# EAGLE design dsbrut2_2bit (EAGLE 6.5.0)
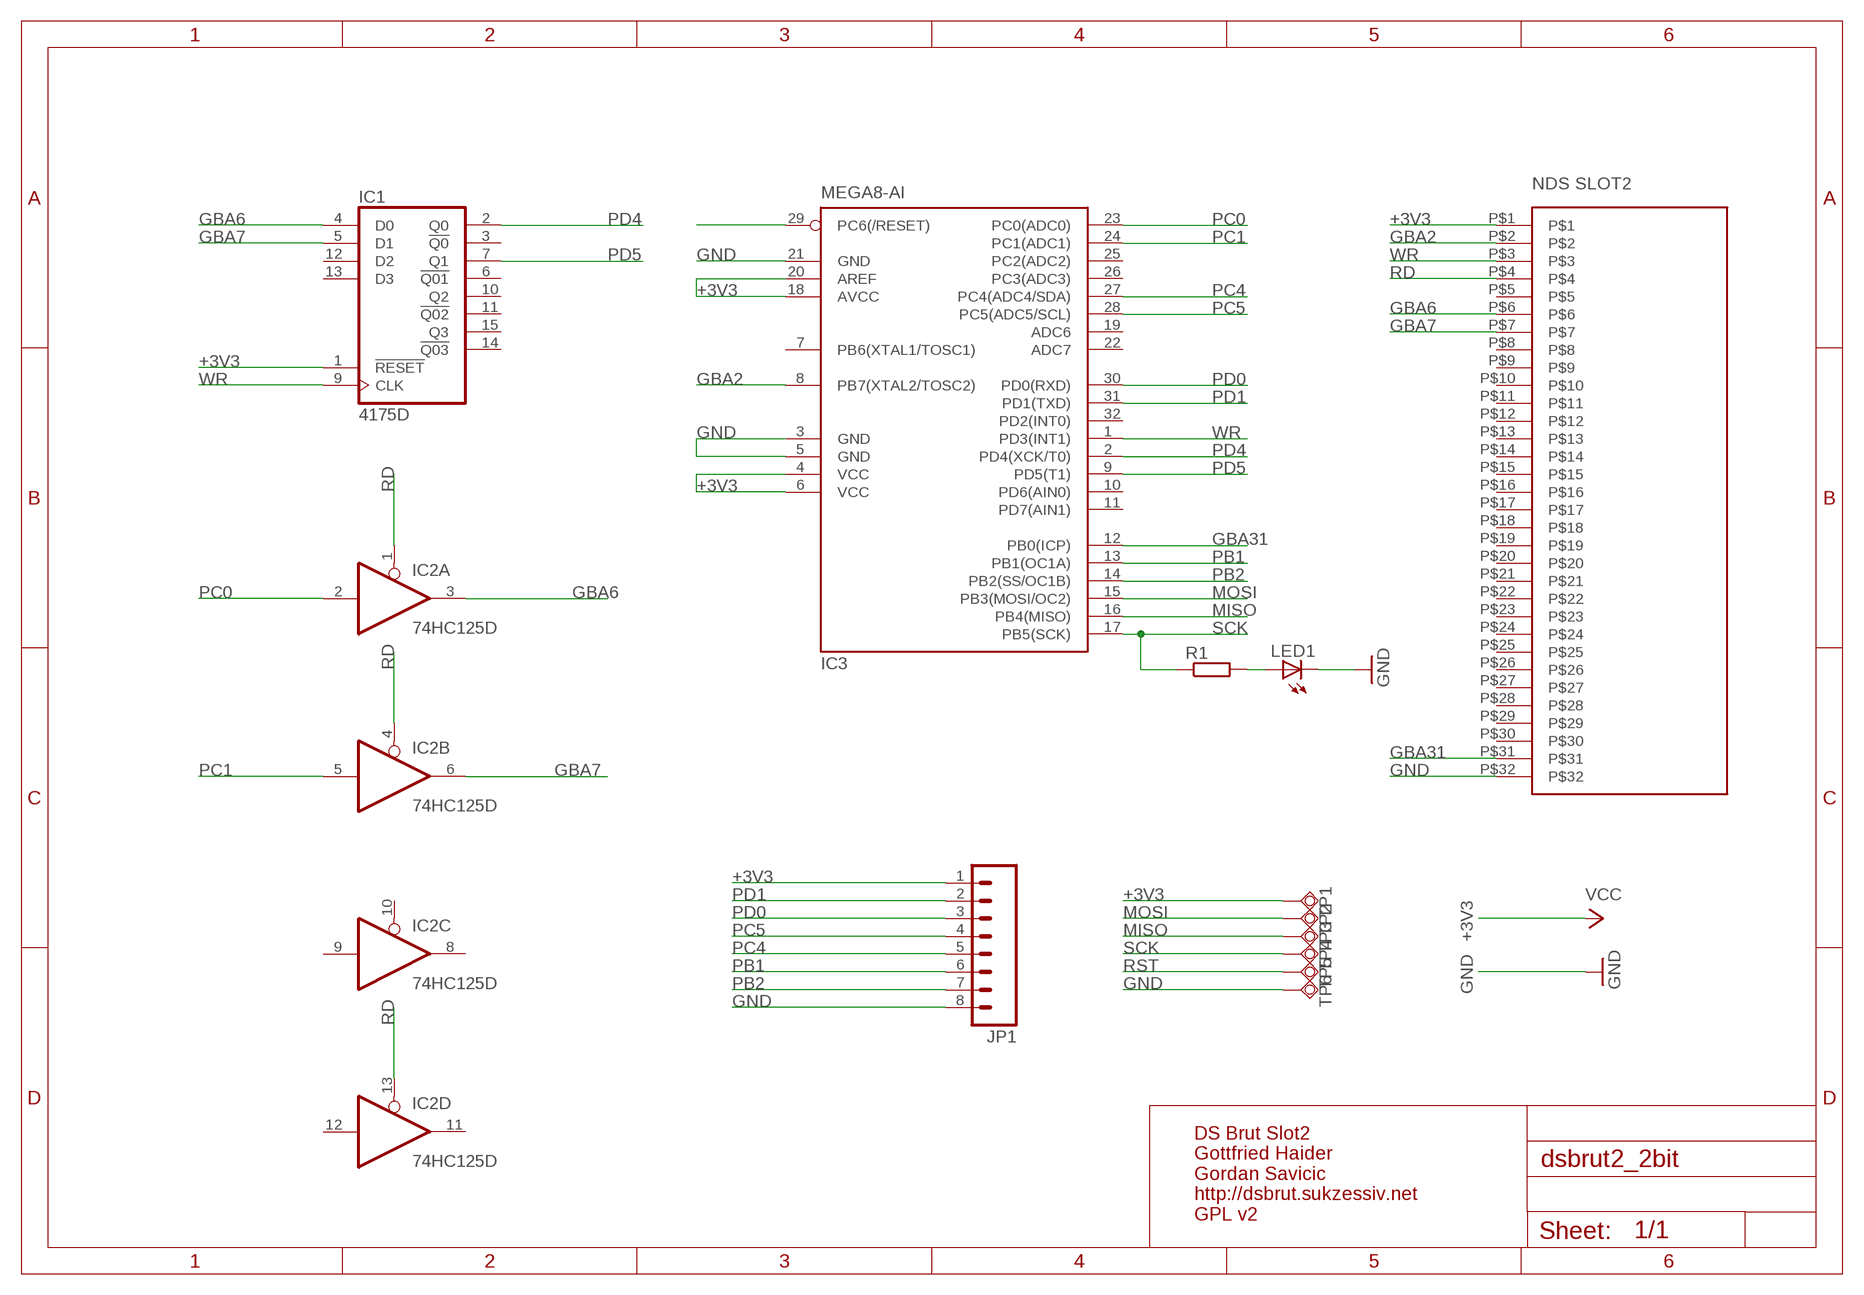
[diagram p0: schematic, sheet 1]

## Parts
IC1  4175D  [SO16]
IC2  74HC125D  [SO14]
IC3  MEGA8-AI  [TQFP32-08]
JP1  M08LONGPADS  [1X08_LONGPADS]
LED1  LED0603  [LED-0603]
R1  R-EU_M0805  [M0805]
TP1  TPSQTP16R  [TP16R]
TP2  TPSQTP16R  [TP16R]
TP3  TPSQTP16R  [TP16R]
TP4  TPSQTP16R  [TP16R]
TP5  TPSQTP16R  [TP16R]
TP6  TPSQTP16R  [TP16R]
U$1  DS_CARTRIDGE_SLOT2  [DS-CARTRIDGE-SLOT2]

## Nets
+3V3: IC1.1(!RESET) IC3.4(VCC) IC3.6(VCC) IC3.18(AVCC) IC3.20(AREF) JP1.1 TP1.TP U$1.P$1 ; supply symbol labelled VCC
GBA2: IC3.8(PB7(XTAL2/TOSC2)) U$1.P$2
GBA6: IC1.4(D0) IC2.3(A:O) U$1.P$6
GBA7: IC1.5(D1) IC2.6(B:O) U$1.P$7
GBA31: IC3.12(PB0(ICP)) U$1.P$31
GND: IC3.3(GND) IC3.5(GND) IC3.21(GND) JP1.8 LED1.C TP6.TP U$1.P$32
MISO: IC3.16(PB4(MISO)) TP3.TP
MOSI: IC3.15(PB3(MOSI/OC2)) TP2.TP
N$4: LED1.A R1.2
PB1: IC3.13(PB1(OC1A)) JP1.6
PB2: IC3.14(PB2(SS/OC1B)) JP1.7
PC0: IC2.2(A:I) IC3.23(PC0(ADC0))
PC1: IC2.5(B:I) IC3.24(PC1(ADC1))
PC4: IC3.27(PC4(ADC4/SDA)) JP1.5
PC5: IC3.28(PC5(ADC5/SCL)) JP1.4
PD0: IC3.30(PD0(RXD)) JP1.3
PD1: IC3.31(PD1(TXD)) JP1.2
PD4: IC1.2(Q0) IC3.2(PD4(XCK/T0))
PD5: IC1.7(Q1) IC3.9(PD5(T1))
RD: IC2.1(A:OE) IC2.4(B:OE) IC2.13(D:OE) U$1.P$4
RST: IC3.29(PC6(/RESET)) TP5.TP
SCK: IC3.17(PB5(SCK)) R1.1 TP4.TP
WR: IC1.9(CLK) IC3.1(PD3(INT1)) U$1.P$3
Unconnected: IC1.3(!Q0) IC1.6(!Q01) IC1.10(Q2) IC1.11(!Q02) IC1.12(D2) IC1.13(D3) IC1.14(!Q03) IC1.15(Q3) IC2.8(C:O) IC2.9(C:I) IC2.10(C:OE) IC2.11(D:O) IC2.12(D:I) IC3.7(PB6(XTAL1/TOSC1)) IC3.10(PD6(AIN0)) IC3.11(PD7(AIN1)) IC3.19(ADC6) IC3.22(ADC7) IC3.25(PC2(ADC2)) IC3.26(PC3(ADC3)) IC3.32(PD2(INT0)) U$1.P$5 U$1.P$8 U$1.P$9 U$1.P$10 U$1.P$11 U$1.P$12 U$1.P$13 U$1.P$14 U$1.P$15 U$1.P$16 U$1.P$17 U$1.P$18 U$1.P$19 U$1.P$20 U$1.P$21 U$1.P$22 U$1.P$23 U$1.P$24 U$1.P$25 U$1.P$26 U$1.P$27 U$1.P$28 U$1.P$29 U$1.P$30

## Notes on the sheet
- ATMEGA168 | NDS SLOT2
- EXTERNAL PINHEADER
- PROG PADS
- DS Brut Slot2
  Gottfried Haider
  Gordan Savicic
  http://dsbrut.sukzessiv.net
  GPL v2

## Power pins joined to a net without a drawn wire
+3V3: IC2.14(P:VCC)
GND: IC2.7(P:GND)
VDD: IC1.16(VDD)
VSS: IC1.8(VSS)

## Library data of the parts
IC1 = 40xx:4175: Quad D FLIP FLOP
IC2 = 74xx-eu:74*125: Quad bus BUFFER, 3-state
IC3 = atmel:MEGA8: MICROCONTROLLER 8 Kbytes FLASH, 1 kbytes SRAM, 512 bytes EEPROM, USART, 6-channel 10 bit ADC, 2-channel 8 bit ADC Pin compatible with Atmega48, ATMega88, ATMega168 Source: avr.lbr; MPN: ATMEGA8-16AU; OC_FARNELL: 9171371; OC_NEWARK: 73M8863
JP1 = SparkFun-Connectors:M08: Header 8 Standard 8-pin 0.1" header. Use with straight break away headers (SKU : PRT-00116), right angle break away headers (PRT-00553), swiss pins (PRT-00743), machine pins (PRT-00117), and female headers (PRT-00115).
LED1 = SparkFunEagle-6-6-07:LED: LEDs Standard schematic elements and footprints for 5mm, 3mm, 1206, and 0603 sized LEDs. 5mm - Spark Fun Electronics SKU : COM-00529 (and others)
R1 = rcl:R-EU_: RESISTOR, European symbol
TP1-TP6 = testpad:TPSQ: Test pad
U$1 = nds_cart:DS_CARTRIDGE_SLOT2

## Board
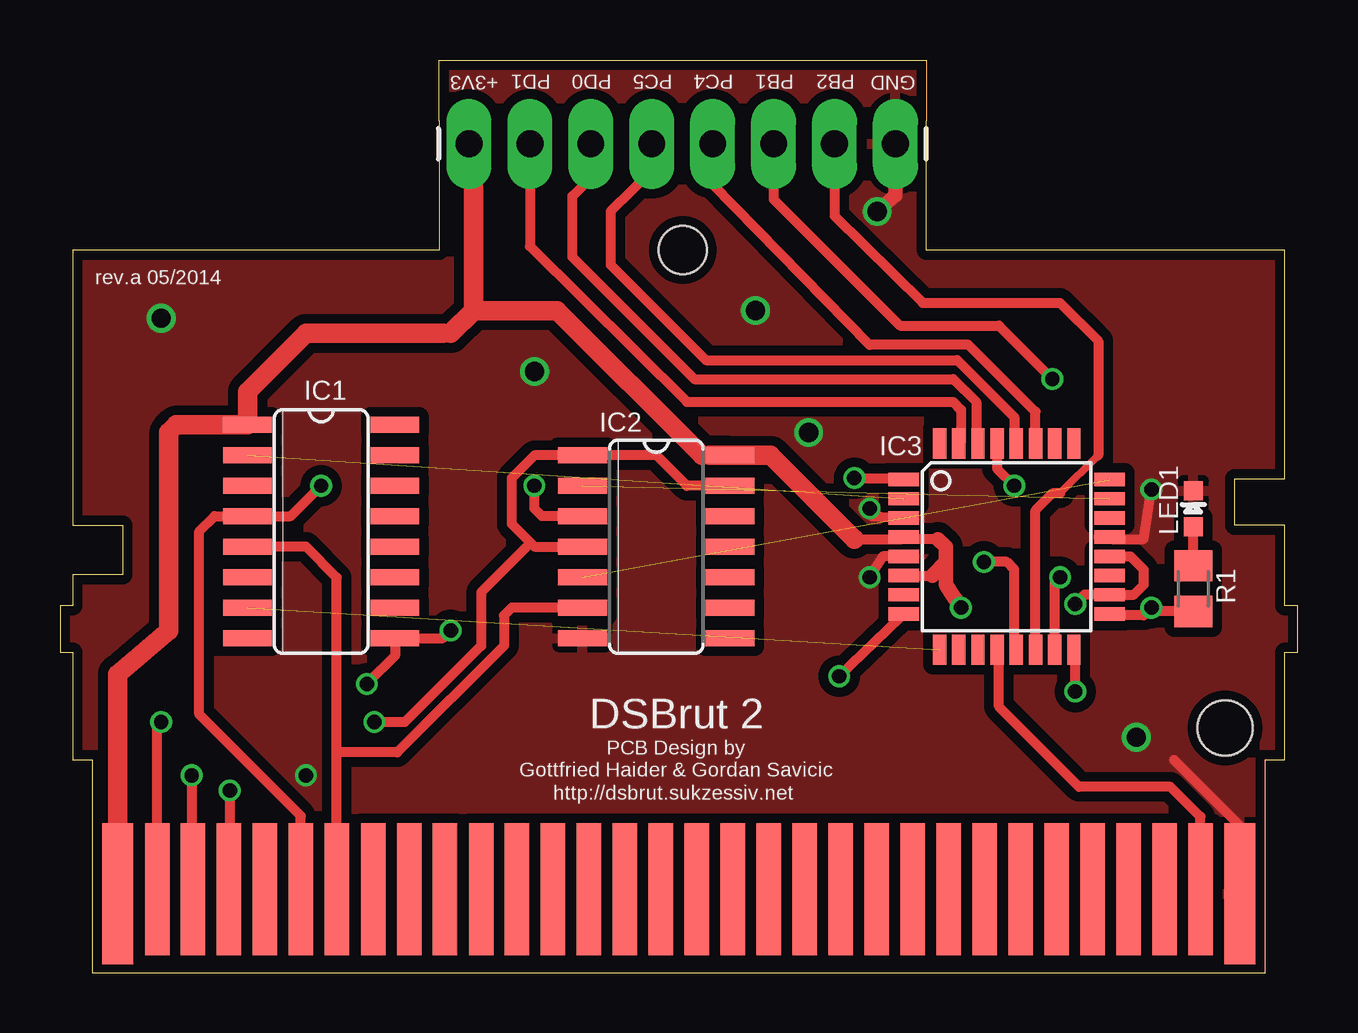
[diagram p1: board, top side]
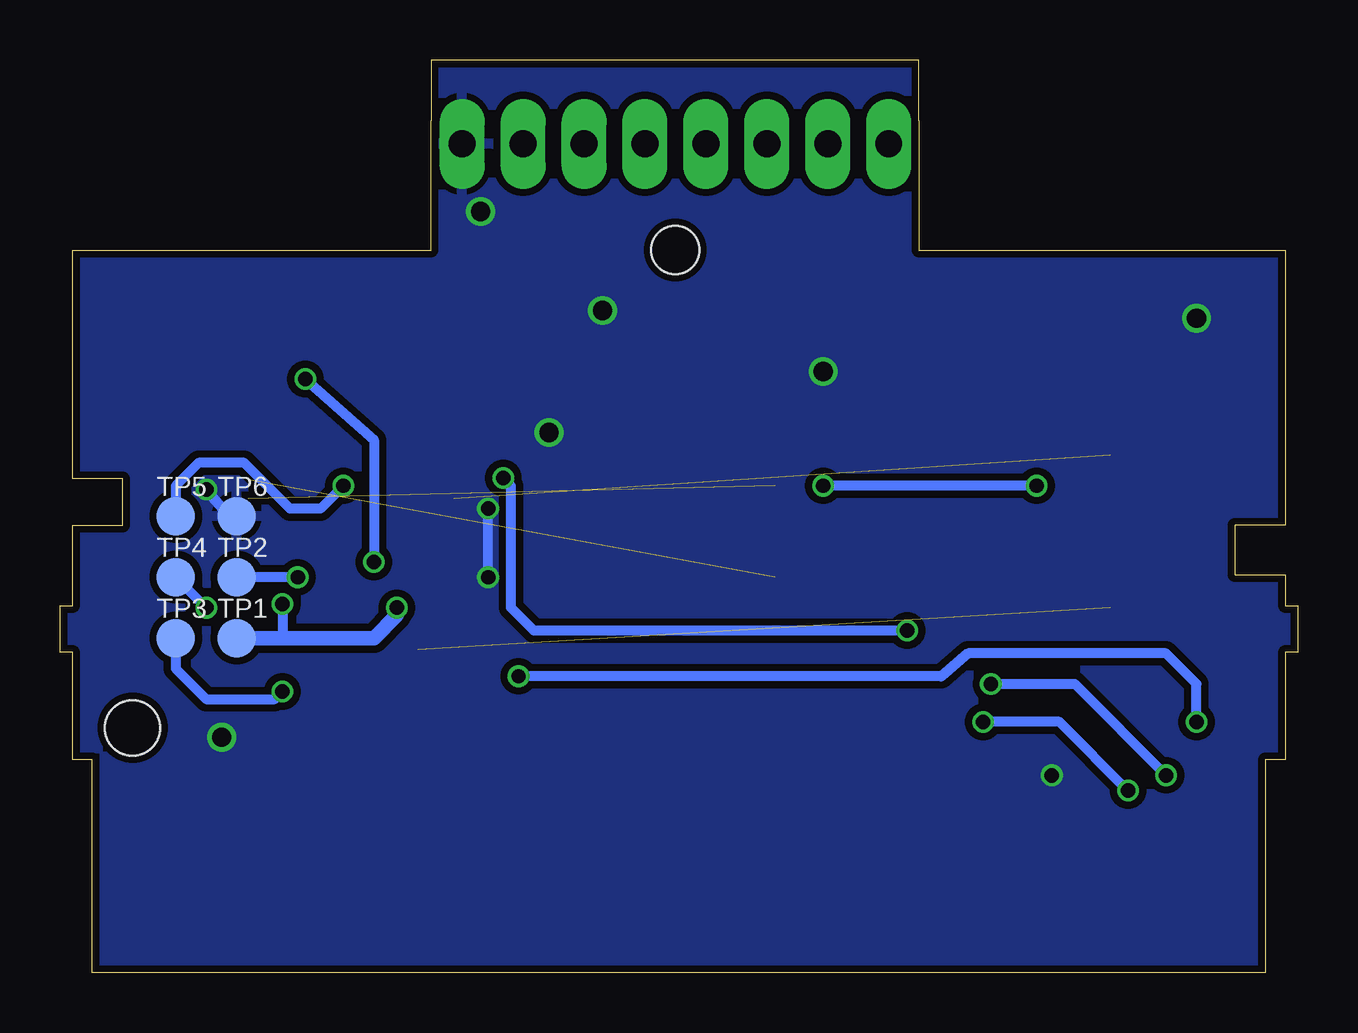
[diagram p2: board, bottom side, seen from below]

Size 51.59 x 38.04 mm. Coordinates in mm from the lower left corner, seen from the top.
Copper layers (1*16): Top 0.035mm / dielectric 1.5mm / Bottom 0.035mm
Design rules "ITEADstudio_DRC": minimum track width 6mil, minimum drill 12mil, track to track 6mil, track to pad 6mil, pad to pad 6mil, via to via 6mil, smd to smd 0mil, copper to edge 10mil, drill to drill 10mil, minimum pad ring 10mil, minimum via ring 6mil, stop-mask expansion 2mil, vias tented up to drill 100mil, thermal gap 10mil

### Footprints (pad centres in the part's own frame; a part is rotated, then mirrored left to right if it is on the bottom)
SO16 = smd 0.66 x 2.032: 1 -4.445,-3.073; 2 -3.175,-3.073; 3 -1.905,-3.073; 4 -0.635,-3.073; 5 0.635,-3.073; 6 1.905,-3.073; 7 3.175,-3.073; 8 4.445,-3.073; 9 4.445,3.073; 10 3.175,3.073; 11 1.905,3.073; 12 0.635,3.073; 13 -0.635,3.073; 14 -1.905,3.073; 15 -3.175,3.073; 16 -4.445,3.073
SO14 = smd 0.66 x 2.032: 1 -3.81,-3.073; 2 -2.54,-3.073; 3 -1.27,-3.073; 4 0,-3.073; 5 1.27,-3.073; 6 2.54,-3.073; 7 3.81,-3.073; 8 3.81,3.073; 9 2.54,3.073; 10 1.27,3.073; 11 0,3.073; 12 -1.27,3.073; 13 -2.54,3.073; 14 -3.81,3.073
TQFP32-08 = smd 1.27 x 0.559: 1 -4.293,2.8; 2 -4.293,2; 3 -4.293,1.2; 4 -4.293,0.4; 5 -4.293,-0.4; 6 -4.293,-1.2; 7 -4.293,-2; 8 -4.293,-2.8; 17 4.293,-2.8; 18 4.293,-2; 19 4.293,-1.2; 20 4.293,-0.4; 21 4.293,0.4; 22 4.293,1.2; 23 4.293,2; 24 4.293,2.8 | smd 0.559 x 1.27: 9 -2.8,-4.293; 10 -2,-4.293; 11 -1.2,-4.293; 12 -0.4,-4.293; 13 0.4,-4.293; 14 1.2,-4.293; 15 2,-4.293; 16 2.8,-4.293; 25 2.8,4.293; 26 2,4.293; 27 1.2,4.293; 28 0.4,4.293; 29 -0.4,4.293; 30 -1.2,4.293; 31 -2,4.293; 32 -2.8,4.293
1X08_LONGPADS = drill 1.118 pad 1.88 long: 1 0,0; 2 2.54,0; 3 5.08,0; 4 7.62,0; 5 10.16,0; 6 12.7,0; 7 15.24,0; 8 17.78,0
LED-0603 = smd 0.8 x 0.8: A 0,-0.75; C 0,0.75
M0805 = smd 1.3 x 1.6: 1 -0.95,0; 2 0.95,0
TP16R = smd 1.6 x 1.6: TP 0,0
DS-CARTRIDGE-SLOT2 = smd 1.3 x 5.865: P$1 1.041,3.325; P$32 47.816,3.325 | smd 1.02 x 5.5: P$2 2.7,3.5; P$3 4.175,3.5; P$4 5.675,3.5; P$5 7.175,3.5; P$6 8.675,3.5; P$7 10.175,3.5; P$8 11.7,3.5; P$9 13.2,3.5; P$10 14.675,3.5; P$11 16.2,3.5; P$12 17.675,3.5; P$13 19.175,3.5; P$14 20.675,3.5; P$15 22.175,3.5; P$16 23.675,3.5; P$17 25.175,3.5; P$18 26.675,3.5; P$19 28.175,3.5; P$20 29.675,3.5; P$21 31.175,3.5; P$22 32.675,3.5; P$23 34.175,3.5; P$24 35.675,3.5; P$25 37.175,3.5; P$26 38.675,3.5; P$27 40.175,3.5; P$28 41.675,3.5; P$29 43.175,3.5; P$30 44.675,3.5; P$31 46.175,3.5 | hole 2.3: 47.202,10.232 | hole 2: 24.592,30.138

### Placement (x,y rotation side)
IC1  10.89,18.39 270 top
IC2  24.86,17.76 270 top
IC3  39.46,17.76 0 top
JP1  17.05,34.54 0 top
LED1  47.24,19.34 0 top
R1  47.24,16.01 90 top
TP1  44.22,13.95 0 bottom
TP2  44.22,16.49 0 bottom
TP3  46.76,13.95 0 bottom
TP4  46.76,16.49 0 bottom
TP5  46.76,19.03 0 bottom
TP6  44.22,19.03 0 bottom
U$1  1.36,-0.02 0 top

### Tracks (layer width: path | path; a pad name or v marks a point on that pad's centre or on a via)
+3V3  (via drill 0.6, 0.6 pad 0.81)
  Top 0.406: IC3.6 36.36,16.56 | 36.6,18.08 35.25,18.08 IC3.4 35.09,18.08 33.11,18.08 | 15.97,26.65 16.28,26.65 | 27.07,21.56 26.75,21.56 | v42.32,15.38 42.7,15.76 IC3.18 44.76,15.76 45.18,16.17 45.18,16.81 44.62,17.36 IC3.20
  Top 0.61: 36.36,16.56 36.92,17.12 | 36.92,17.12 36.92,17.76 36.6,18.08 | 36.92,17.12 36.92,16.17 v37.56,15.22
  Top 0.813: U$1.P$1 2.4,12.45 4.54,14.26 4.54,22.52 4.85,22.84 IC1.1 7.81,24.21 10.25,26.65 15.97,26.65 | 27.07,21.56 IC2.14 29.62,21.57 33.11,18.08 | JP1.1 17.24,32.68 17.24,27.6 | 16.28,26.65 17.24,27.6 | 26.75,21.56 20.73,27.6 17.24,27.6
  Bottom 0.406: v42.32,15.38 42.32,14.11 42.16,13.95
  Bottom 0.61: v37.56,15.22 37.56,14.9 38.51,13.95 42.16,13.95 TP1.TP
GBA2  (via drill 0.6)
  Top 0.406: U$1.P$2 4.06,10.3 v4.22,10.45 | v32.48,12.36 35.02,14.81 IC3.8
  Bottom 0.406: v4.22,10.45 4.22,12.04 5.49,13.31 13.74,13.31 14.86,12.36 v32.48,12.36
GBA6  (via drill 0.6)
  Top 0.406: U$1.P$6 10.04,6.54 5.81,10.77 5.81,18.39 6.44,19.03 IC1.4 9.62,19.03 v10.89,20.3 | IC2.3 20.09,19.03 19.78,19.34 v19.78,20.3
  Bottom 0.406: v10.89,20.3 v19.78,20.3
GBA7
  Top 0.406: U$1.P$7 11.54,9.18 | 11.54,9.18 11.54,16.47 10.25,17.76 IC1.5 | IC2.6 18.82,15.22 18.51,14.9 18.51,13.63 14.06,9.18 11.54,9.18
GBA31
  Top 0.406: U$1.P$31 47.54,6.51 46.29,7.76 42.48,7.76 39.14,11.09 39.14,13.38 IC3.12
GND  (via drill 0.6, 0.8, 0.8 pad 0.81)
  Top 0.406: IC3.5 34.3,17.36 v33.75,16.49 | v33.75,19.34 33.83,19.03 IC3.3 | IC3.21 43.84,18.08 45.18,18.08 v45.49,20.14 | U$1.P$32 49.18,6.14 46.45,8.87
  Top 0.61: v34.06,31.73 34.81,32.4 JP1.8
  Bottom 0.406: v33.75,16.49 v33.75,19.34 | TP6.TP 44.54,19.03 v45.49,20.14
  other vias: 19.78,25.06 31.21,22.52 4.22,27.28 28.98,27.6 10.25,8.23 44.86,9.82
  pour Top (isolate 0.406): -0.54,-1.29 52.8,-1.29 52.8,39.98 -0.54,39.98
  pour Bottom (isolate 0.305): -0.54,-1.29 52.8,-1.29 52.8,39.98 -0.54,39.98
MISO  (via drill 0.6)
  Top 0.406: v42.32,11.73 42.32,13.41 IC3.16
  Bottom 0.406: TP3.TP 46.76,12.68 45.49,11.41 42.64,11.41 v42.32,11.73
MOSI  (via drill 0.6)
  Top 0.406: IC3.15 41.46,16.27 v41.68,16.49
  Bottom 0.406: v41.68,16.49 TP2.TP
N$4
  Top 0.406: R1.2 LED1.A
PB1  (via drill 0.6)
  Top 0.406: JP1.6 29.75,32.23 35.02,26.97 39.14,26.97 v41.37,24.74 | IC3.13 39.78,13.55 39.78,16.81 39.46,17.12 v38.51,17.12
  Bottom 0.406: v41.37,24.74 38.51,22.2 v38.51,17.12
PB2
  Top 0.305: 43.27,21.57 41.68,19.98
  Top 0.406: IC3.14 40.66,19.27 41.37,19.98 41.68,19.98 | JP1.7 32.29,31.54 35.97,27.92 41.68,27.92 43.27,26.33 43.27,21.57
PC0  (1 unrouted)
PC1  (1 unrouted)
PC4
  Top 0.406: IC3.27 40.66,23.38 37.87,26.17 33.75,26.17 27.21,32.86 JP1.5
PC5
  Top 0.406: JP1.4 24.67,33.42 22.95,31.73 22.95,29.5 26.92,25.54 37.4,25.54 39.78,23.15 39.78,22.13 IC3.28
PD0
  Top 0.406: IC3.30 38.19,22.12 38.19,23.79 37.24,24.74 26.44,24.74 21.36,29.82 21.36,32.36 22.13,33.13 JP1.3
PD1
  Top 0.406: JP1.2 19.59,30.27 26.13,23.79 37.24,23.79 37.56,23.47 37.56,22.15 IC3.31
PD4  (1 unrouted)
PD5  (1 unrouted)
RD  (via drill 0.6)
  Top 0.406: 19.62,17.92 18.82,18.71 18.82,20.61 19.78,21.57 IC2.1 24.86,21.57 26.13,20.3 IC2.13 | 19.62,17.92 19.78,17.76 IC2.4 | v7.08,7.6 7.08,3.52 U$1.P$4 | v13.11,10.45 14.38,10.45 17.55,13.63 17.55,15.85 19.62,17.92
  Bottom 0.406: v7.08,7.6 9.93,10.45 v13.11,10.45
RST  (via drill 0.6)
  Top 0.406: IC3.29 39.06,21.02 v39.78,20.3
  Bottom 0.406: v39.78,20.3 40.73,19.34 42,19.34 43.91,21.25 45.81,21.25 46.76,20.3 TP5.TP
SCK  (via drill 0.6)
  Top 0.406: v45.49,15.22 45.18,14.9 43.81,14.9 IC3.17 | 45.62,15.25 v45.49,15.22 | R1.1 45.65,15.06 v45.49,15.22
  Bottom 0.406: TP4.TP v45.49,15.22
WR  (via drill 0.6)
  Top 0.406: v12.79,12.04 13.96,13.21 IC1.9 15.97,13.95 v16.28,14.26 | v5.49,8.23 5.49,3.52 U$1.P$3 | v33.11,20.61 35.11,20.61 IC3.1
  Bottom 0.406: v12.79,12.04 9.3,12.04 v5.49,8.23 | v33.11,20.61 32.79,20.3 32.79,15.22 31.84,14.26 v16.28,14.26

### Text on the board
tNames: +3V3 | PD1 | PD0 | PC5 | PC4 | PB1 | PB2 | GND | rev.a 05/2014 | DSBrut 2 | PCB Design by / Gottfried Haider & Gordan Savicic | http://dsbrut.sukzessiv.net